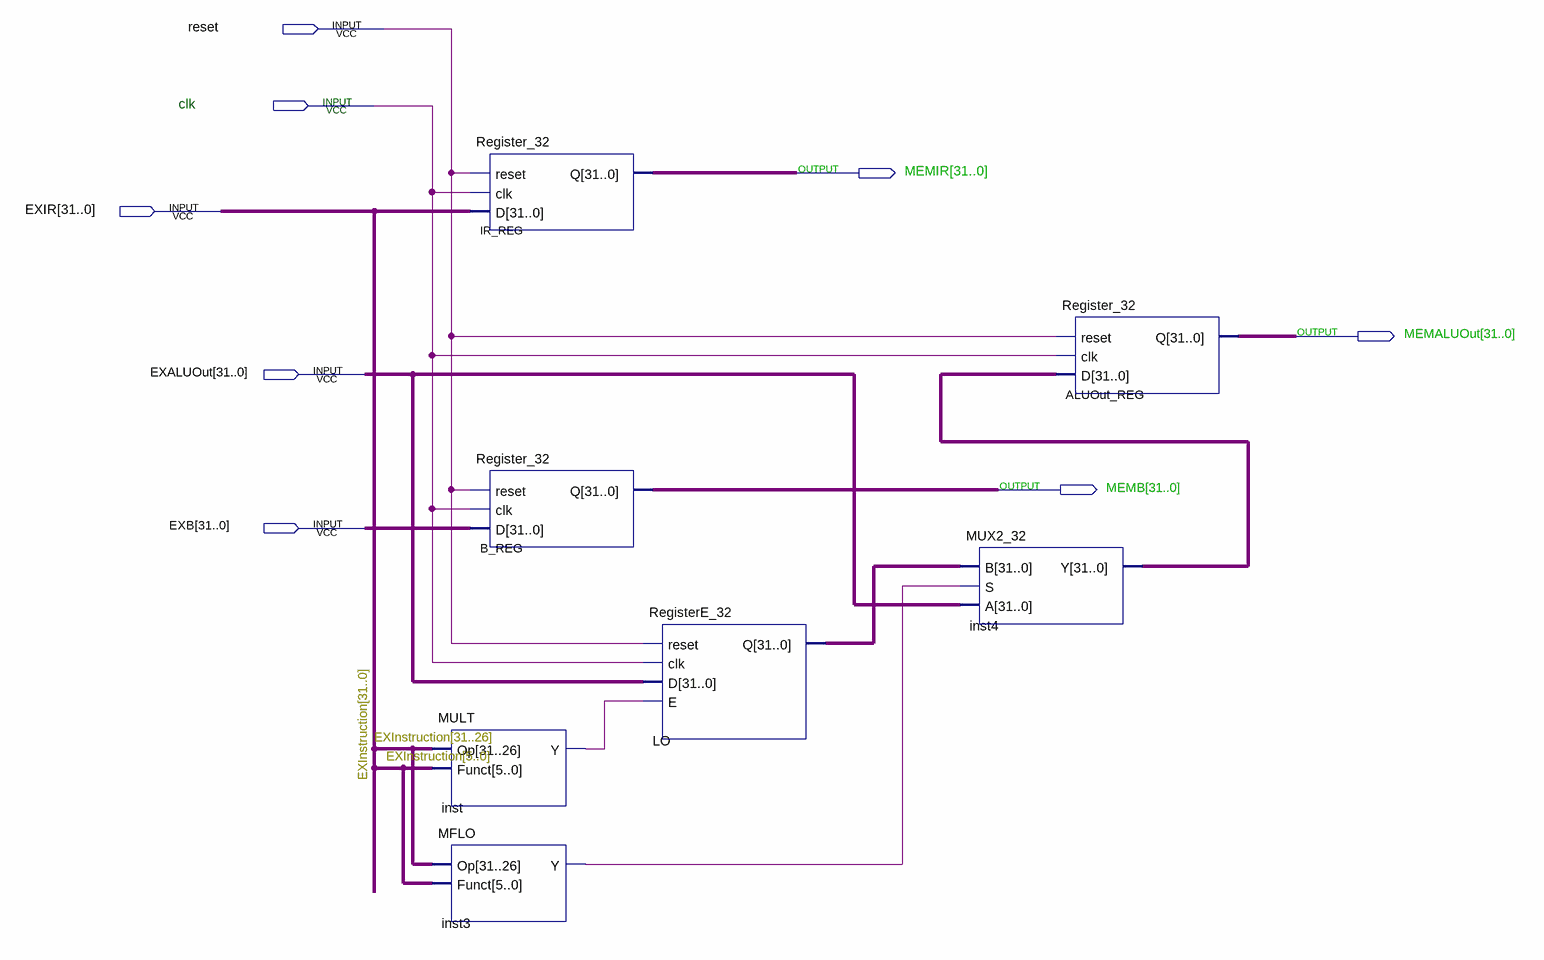
[diagram p0: schematic sheet]
// Quartus schematic EXMEMTower.bdf as structural Verilog: 7 symbols, 8 pins
module EXMEMTower (
  input  reset,
  input  clk,
  input  [31:0] EXIR,
  input  [31:0] EXALUOut,
  input  [31:0] EXB,
  output [31:0] MEMIR,
  output [31:0] MEMALUOut,
  output [31:0] MEMB
);

  wire inst3_y, inst_y;
  wire [31:0] inst4_y, LO_q;

  MULT inst (.Op(EXIR[31:26]), .Funct(EXIR[5:0]), .Y(inst_y));
  MFLO inst3 (.Op(EXIR[31:26]), .Funct(EXIR[5:0]), .Y(inst3_y));
  Register_32 IR_REG (.reset(reset), .clk(clk), .D(EXIR), .Q(MEMIR));
  Register_32 B_REG (.reset(reset), .clk(clk), .D(EXB), .Q(MEMB));
  RegisterE_32 LO (.reset(reset), .clk(clk), .D(EXALUOut), .E(inst_y), .Q(LO_q));
  MUX2_32 inst4 (.B(LO_q), .S(inst3_y), .A(EXALUOut), .Y(inst4_y));
  Register_32 ALUOut_REG (.reset(reset), .clk(clk), .D(inst4_y), .Q(MEMALUOut));

  // Other names for the same wires on the sheet: EXInstruction[31:0] = EXIR
endmodule
